# Altium project HT_SHAJUN_PCB.PrjPcb
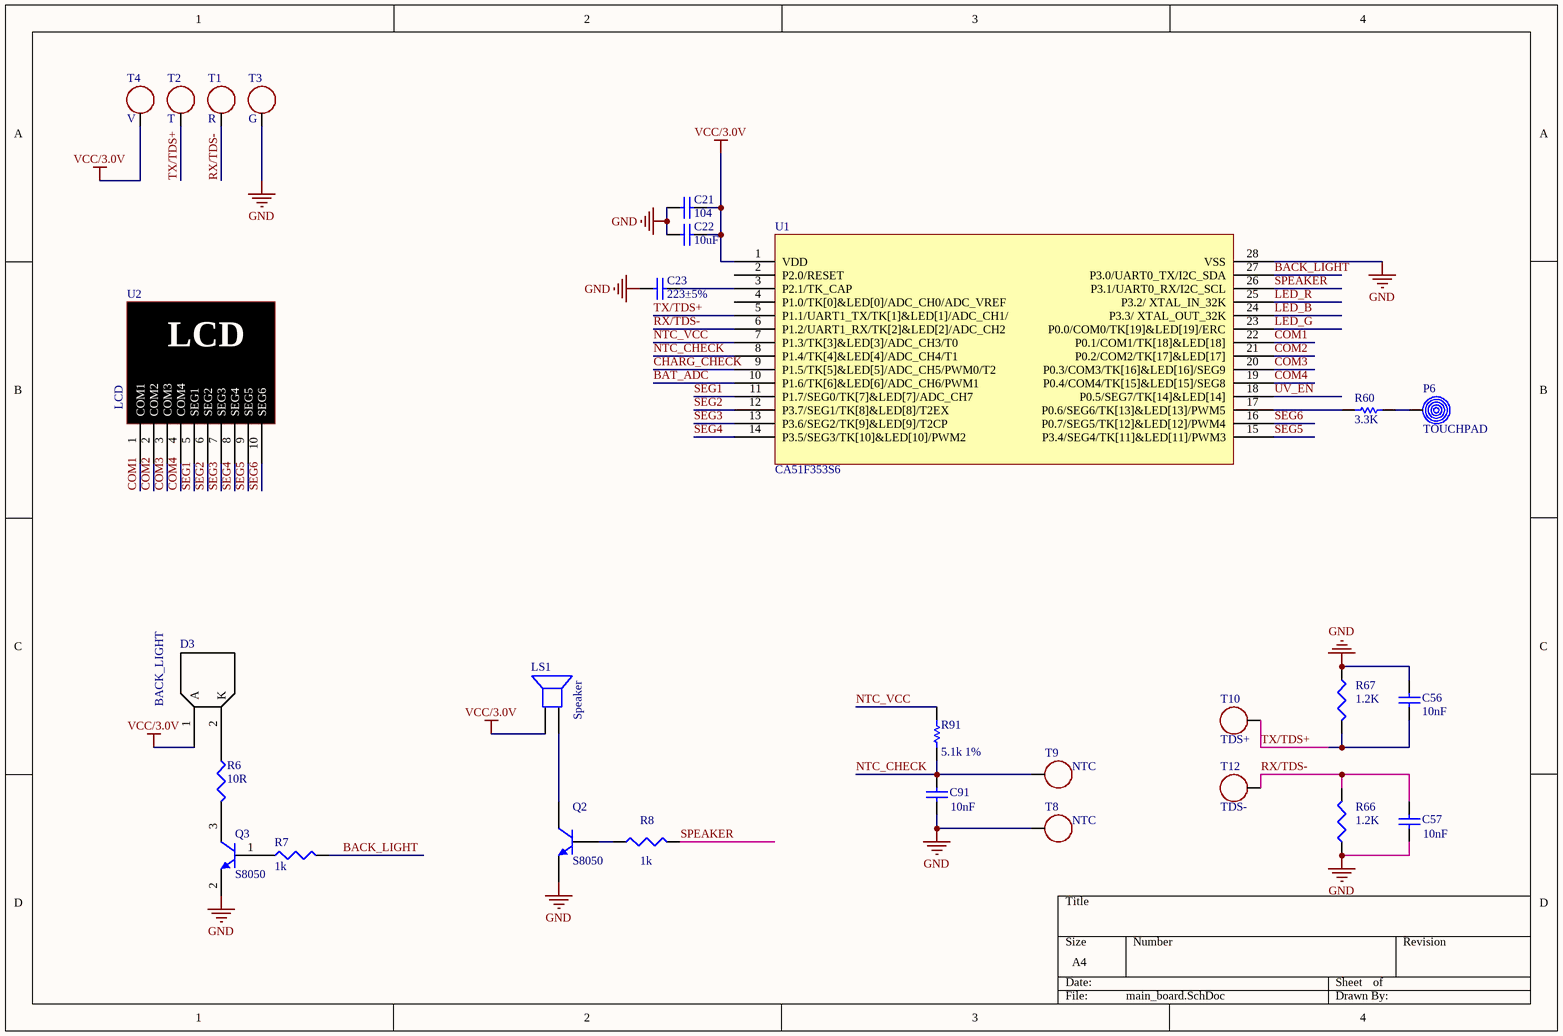
[diagram p0: main_board.SchDoc]
3 sheets, 88 parts. Net scope: global (net labels, ports and power ports of the same name join across sheets).
Board files: SHAJUN_MAIN_PCB.PcbDoc, SHAJUN_VU_PCB.PcbDoc
Sheets:
  main_board.SchDoc
  power_board.SchDoc
  UV_board.SchDoc

## Sheet main_board.SchDoc
size A4

### Parts
C21  value 104  [C0402]  (hidden comment: Cap)
C22  value 10uF  [C0805]  (hidden comment: Cap)
C23  value 223±5%  [C0402]  (hidden comment: Cap)
C56  value 10nF  [C0402]  (hidden comment: Cap)
C57  value 10nF  [C0402]  (hidden comment: Cap)
C91  value 10nF  [C0402]  (hidden comment: Cap)
D3  BACK_LIGHT  [BACK_LIGHT]
LS1  Speaker  [SPEAK]
P6  TOUCHPAD  [TP2MMAAA]
Q2  S8050  [SOT23]
Q3  S8050  [SOT23]
R6  value 10R  [R0402]  (hidden comment: 1.2k)
R7  value 1k  [R0402]  (hidden comment: 1.2k)
R8  value 1k  [R0402]  (hidden comment: 1.2k)
R60  value 3.3K  [R0402]  (hidden comment: Res1)
R66  1.2k  [R0402]
R67  1.2k  [R0402]
R91  value 5.1k 1%  [R0402]  (hidden comment: Res1)
T1  R  [TP1_3MMD]
T2  T  [TP1_3MMD]
T3  G  [TP1_3MMD]
T4  V  [TP1_3MMD]
T8  NTC  [TP1_3MMD]
T9  NTC  [TP1_3MMD]
T10  TDS+  [TP1_3MMD]
T12  TDS-  [TP1_3MMD]
U1  CA51F353S6  [CA51F35S6-SOP28]
U2  LCD  [LCD_DISPLAY]

### Nets
GND: C21.1 C22.1 C23.1 C56.1 C57.1 C91.1 Q2.2(E) Q3.2(E) R66.1 R67.1 T3.1(TOUCHPAD) T8.1(TOUCHPAD) U1.28(VSS)
VCC/3.0V: C21.2 C22.2 D3.1(A) LS1.1 T4.1(TOUCHPAD) U1.1(VDD)
BACK_LIGHT: R7.2 U1.27(P3.0/UART0_TX/I2C_SDA)
BAT_ADC: U1.10(P1.6/TK[6]&LED[6]/ADC_CH6/PWM1)
CHARG_CHECK: U1.9(P1.5/TK[5]&LED[5]/ADC_CH5/PWM0/T2)
COM1: U1.22(P0.1/COM1/TK[18]&LED[18]) U2.1(COM1)
COM2: U1.21(P0.2/COM2/TK[17]&LED[17]) U2.2(COM2)
COM3: U1.20(P0.3/COM3/TK[16]&LED[16]/SEG9) U2.3(COM3)
COM4: U1.19(P0.4/COM4/TK[15]&LED[15]/SEG8) U2.4(COM4)
LED_B: U1.24(P3.3/_XTAL_OUT_32K)
LED_G: U1.23(P0.0/COM0/TK[19]&LED[19]/ERC)
LED_R: U1.25(P3.2/_XTAL_IN_32K)
NTC_CHECK: C91.2 R91.1 T9.1(TOUCHPAD) U1.8(P1.4/TK[4]&LED[4]/ADC_CH4/T1)
NTC_VCC: R91.2 U1.7(P1.3/TK[3]&LED[3]/ADC_CH3/T0)
RX/TDS-: C57.2 R66.2 T1.1(TOUCHPAD) T12.1(TOUCHPAD) U1.6(P1.2/UART1_RX/TK[2]&LED[2]/ADC_CH2)
SEG1: U1.11(P1.7/SEG0/TK[7]&LED[7]/ADC_CH7) U2.5(SEG1)
SEG2: U1.12(P3.7/SEG1/TK[8]&LED[8]/T2EX) U2.6(SEG2)
SEG3: U1.13(P3.6/SEG2/TK[9]&LED[9]/T2CP) U2.7(SEG3)
SEG4: U1.14(P3.5/SEG3/TK[10]&LED[10]/PWM2) U2.8(SEG4)
SEG5: U1.15(P3.4/SEG4/TK[11]&LED[11]/PWM3) U2.9(SEG5)
SEG6: U1.16(P0.7/SEG5/TK[12]&LED[12]/PWM4) U2.10(SEG6)
SPEAKER: R8.2 U1.26(P3.1/UART0_RX/I2C_SCL)
TX/TDS+: C56.2 R67.2 T2.1(TOUCHPAD) T10.1(TOUCHPAD) U1.5(P1.1/UART1_TX/TK[1]&LED[1]/ADC_CH1/)
UV_EN: U1.18(P0.5/SEG7/TK[14]&LED[14])
NetC23_2: C23.2 U1.3(P2.1/TK_CAP)
NetD3_2: D3.2(K) R6.1
NetLS1_2: LS1.2 Q2.3(C)
NetP6_1: P6.1(TOUCHPAD) R60.1
NetQ2_1: Q2.1(B) R8.1
NetQ3_1: Q3.1(B) R7.1
NetQ3_3: Q3.3(C) R6.2
NetR60_2: R60.2 U1.17(P0.6/SEG6/TK[13]&LED[13]/PWM5)

Not connected (* = marked no-connect by the designer): U1 2(P2.0/RESET) 4(P1.0/TK[0]&LED[0]/ADC_CH0/ADC_VREF)

### Library data of the parts
C21-C23 C56 C57 C91 = Cap: 电容; Published: 8-Jun-2000; LatestRevisionDate: 17-Jul-2002; LatestRevisionNote: Re-released for DXP Platform.; PackageReference: RAD-0.3; Publisher: Altium Limited; PackageDescription: Radial Cap, Thru-Hole; 2 Leads; 0.3 in Pin Spacing
D3 = BACK_LIGHT: LCD背光
LS1 = Speaker: 蜂鸣器; Published: 24-Mar-1999; LatestRevisionDate: 17-Jul-2002; LatestRevisionNote: Re-released for DXP Platform.; PackageReference: PIN2; Publisher: Altium Limited
P6 = TOUCHPAD: 触摸弹簧
Q2 Q3 = S8050: 三极管
R6-R8 R66 R67 = Res3: 电阻; Published: 8-Jun-2000; LatestRevisionDate: 29-May-2009; LatestRevisionNote: IPC-7351 Footprint Added.; PackageReference: J1-0603; Publisher: Altium Limited; PackageDescription: Chip Resistor
  R66 R67: Value: 1.2K
R60 R91 = Res1: 电阻; Published: 8-Jun-2000; LatestRevisionDate: 17-Jul-2002; LatestRevisionNote: Re-released for DXP Platform.; PackageReference: AXIAL-0.3; Publisher: Altium Limited; PackageDescription: Axial Device, Thru-Hole; 2 Leads; 0.3 in Pin Spacing
T1 = TEST: 烧录点Rx
T2 = TEST: 烧录点Tx
T3 = TEST: 烧录点GND
T4 = TEST: 烧录点VCC
T8 T9 = TEST: NTC焊点
T10 T12 = TEST: TDS焊点
U1 = CA51F353S6: 主控IC
U2 = LCD: LCD显示屏

## Sheet power_board.SchDoc
size A4
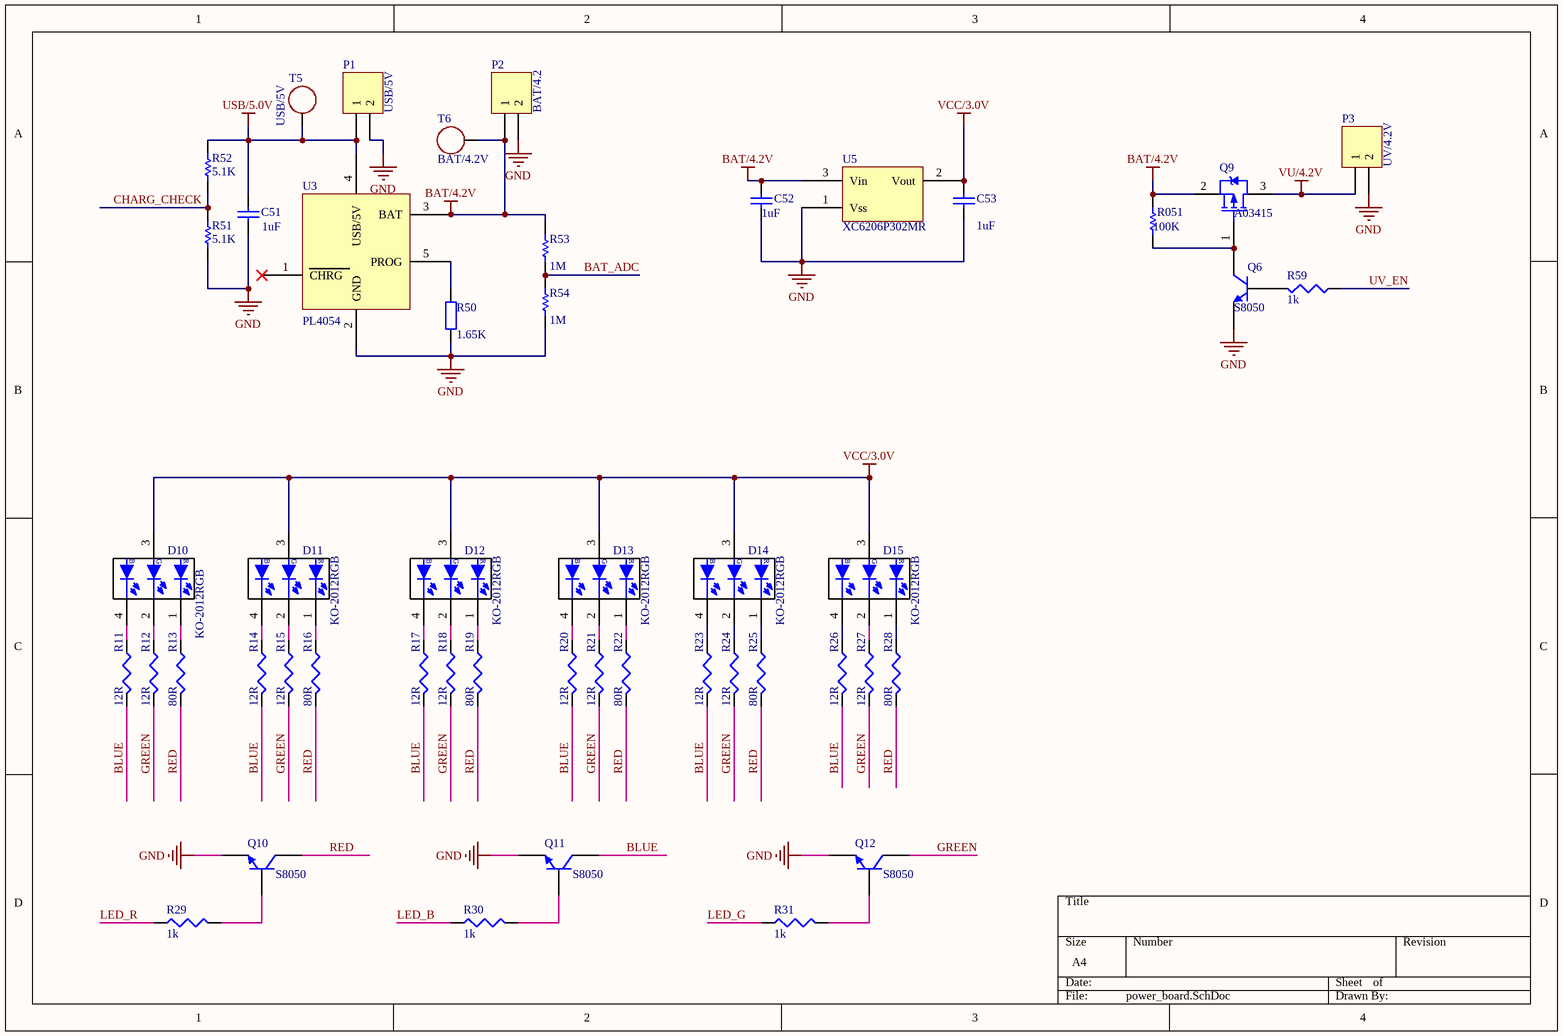
[diagram p1: power_board.SchDoc]

### Parts
C51  value 1uF  [C0402]  (hidden comment: Cap)
C52  value 1uF  [C0402]  (hidden comment: Cap)
C53  value 1uF  [C0402]  (hidden comment: Cap)
D10  KO-2012RGB  [KO-2012RGB]
D11  KO-2012RGB  [KO-2012RGB]
D12  KO-2012RGB  [KO-2012RGB]
D13  KO-2012RGB  [KO-2012RGB]
D14  KO-2012RGB  [KO-2012RGB]
D15  KO-2012RGB  [KO-2012RGB]
P1  USB/5V  [USB5.0V]
P2  BAT/4.2  [CON_1.25MM_2P]
P3  UV/4.2V  [CON_1.25MM_2P]
Q6  S8050  [SOT23]
Q9  A03415  [SOT23]
Q10  S8050  [SOT23]
Q11  S8050  [SOT23]
Q12  S8050  [SOT23]
R11  value 12R  [R0402]  (hidden comment: 1.2k)
R12  value 12R  [R0402]  (hidden comment: 1.2k)
R13  value 80R  [R0402]  (hidden comment: 1.2k)
R14  value 12R  [R0402]  (hidden comment: 1.2k)
R15  value 12R  [R0402]  (hidden comment: 1.2k)
R16  value 80R  [R0402]  (hidden comment: 1.2k)
R17  value 12R  [R0402]  (hidden comment: 1.2k)
R18  value 12R  [R0402]  (hidden comment: 1.2k)
R19  value 80R  [R0402]  (hidden comment: 1.2k)
R20  value 12R  [R0402]  (hidden comment: 1.2k)
R21  value 12R  [R0402]  (hidden comment: 1.2k)
R22  value 80R  [R0402]  (hidden comment: 1.2k)
R23  value 12R  [R0402]  (hidden comment: 1.2k)
R24  value 12R  [R0402]  (hidden comment: 1.2k)
R25  value 80R  [R0402]  (hidden comment: 1.2k)
R26  value 12R  [R0402]  (hidden comment: 1.2k)
R27  value 12R  [R0402]  (hidden comment: 1.2k)
R28  value 80R  [R0402]  (hidden comment: 1.2k)
R29  value 1k  [R0402]  (hidden comment: 1.2k)
R30  value 1k  [R0402]  (hidden comment: 1.2k)
R31  value 1k  [R0402]  (hidden comment: 1.2k)
R50  value 1.65K  [R0402]  (hidden comment: Res2)
R51  value 5.1K  [R0402]  (hidden comment: Res1)
R051  value 100K  [R0402]  (hidden comment: Res1)
R52  value 5.1K  [R0402]  (hidden comment: Res1)
R53  value 1M  [R0402]  (hidden comment: Res1)
R54  value 1M  [R0402]  (hidden comment: Res1)
R59  value 1k  [R0402]  (hidden comment: 1.2k)
T5  USB/5V  [TP1_3MMD]
T6  BAT/4.2V  [TP1_3MMD]
U3  PL4054  [SOT23-5]
U5  XC6206P302MR  [SOT23]

### Nets
BAT/4.2V: C52.2 P2.1 Q9.2(S) R051.2 R53.2 T6.1(TOUCHPAD) U3.3(BAT) U5.3(Vin)
GND: C51.1 C52.1 C53.1 P1.2 P2.2 P3.2 Q6.2(E) Q10.2(E) Q11.2(E) Q12.2(E) R50.1 R51.1 R54.1 U3.2(GND) U5.1(Vss)
USB/5.0V: C51.2 P1.1 R52.2 T5.1(TOUCHPAD) U3.4(USB/5V)
VCC/3.0V: C53.2 D10.3(+) D11.3(+) D12.3(+) D13.3(+) D14.3(+) D15.3(+) U5.2(Vout)
VU/4.2V: P3.1 Q9.3(D)
BAT_ADC: R53.1 R54.2
BLUE: Q11.3(C) R11.2 R14.2 R17.2 R20.2 R23.2 R26.2
CHARG_CHECK: R51.2 R52.1
GREEN: Q12.3(C) R12.2 R15.2 R18.2 R21.2 R24.2 R27.2
LED_B: R30.1
LED_G: R31.1
LED_R: R29.1
RED: Q10.3(C) R13.2 R16.2 R19.2 R22.2 R25.2 R28.2
UV_EN: R59.1
NetD10_1: D10.1(R) R13.1
NetD10_2: D10.2(G) R12.1
NetD10_4: D10.4(B) R11.1
NetD11_1: D11.1(R) R16.1
NetD11_2: D11.2(G) R15.1
NetD11_4: D11.4(B) R14.1
NetD12_1: D12.1(R) R19.1
NetD12_2: D12.2(G) R18.1
NetD12_4: D12.4(B) R17.1
NetD13_1: D13.1(R) R22.1
NetD13_2: D13.2(G) R21.1
NetD13_4: D13.4(B) R20.1
NetD14_1: D14.1(R) R25.1
NetD14_2: D14.2(G) R24.1
NetD14_4: D14.4(B) R23.1
NetD15_1: D15.1(R) R28.1
NetD15_2: D15.2(G) R27.1
NetD15_4: D15.4(B) R26.1
NetQ6_1: Q6.1(B) R59.2
NetQ6_3: Q6.3(C) Q9.1(G) R051.1
NetQ10_1: Q10.1(B) R29.2
NetQ11_1: Q11.1(B) R30.2
NetQ12_1: Q12.1(B) R31.2
NetR50_2: R50.2 U3.5(PROG)

Not connected (* = marked no-connect by the designer): U3 1(CHRG)*

### Library data of the parts
C51-C53 = Cap: 电容; Published: 8-Jun-2000; LatestRevisionDate: 17-Jul-2002; LatestRevisionNote: Re-released for DXP Platform.; PackageReference: RAD-0.3; Publisher: Altium Limited; PackageDescription: Radial Cap, Thru-Hole; 2 Leads; 0.3 in Pin Spacing
D10-D15 = KO-2012RGB: 三色LED
P1 = Header 2: 充电焊接口; LatestRevisionDate: 17-Jul-2002; LatestRevisionNote: Re-released for DXP Platform.; Publisher: Altium Limited
P2 = Header 2: 电池连接母座; LatestRevisionDate: 17-Jul-2002; LatestRevisionNote: Re-released for DXP Platform.; Publisher: Altium Limited
P3 = Header 2: UV灯接口; LatestRevisionDate: 17-Jul-2002; LatestRevisionNote: Re-released for DXP Platform.; Publisher: Altium Limited
Q6 Q10-Q12 = S8050: 三极管
Q9 = A03415: PMOS管
R11-R31 R59 = Res3: 电阻; Published: 8-Jun-2000; LatestRevisionDate: 29-May-2009; LatestRevisionNote: IPC-7351 Footprint Added.; PackageReference: J1-0603; Publisher: Altium Limited; PackageDescription: Chip Resistor
R50 = Res2: 电阻; Published: 8-Jun-2000; LatestRevisionDate: 17-Jul-2002; LatestRevisionNote: Re-released for DXP Platform.; PackageReference: AXIAL-0.4; Publisher: Altium Limited; PackageDescription: Axial Device, Thru-Hole; 2 Leads; 0.4 in Pin Spacing
R51 R051-R54 = Res1: 电阻; Published: 8-Jun-2000; LatestRevisionDate: 17-Jul-2002; LatestRevisionNote: Re-released for DXP Platform.; PackageReference: AXIAL-0.3; Publisher: Altium Limited; PackageDescription: Axial Device, Thru-Hole; 2 Leads; 0.3 in Pin Spacing
T5 = TEST: USB充电检测点
T6 = TEST: 电池检测点
U3 = PL4054: 充电IC
U5 = XC6206P302MR: 稳压IC

## Sheet UV_board.SchDoc
size A4
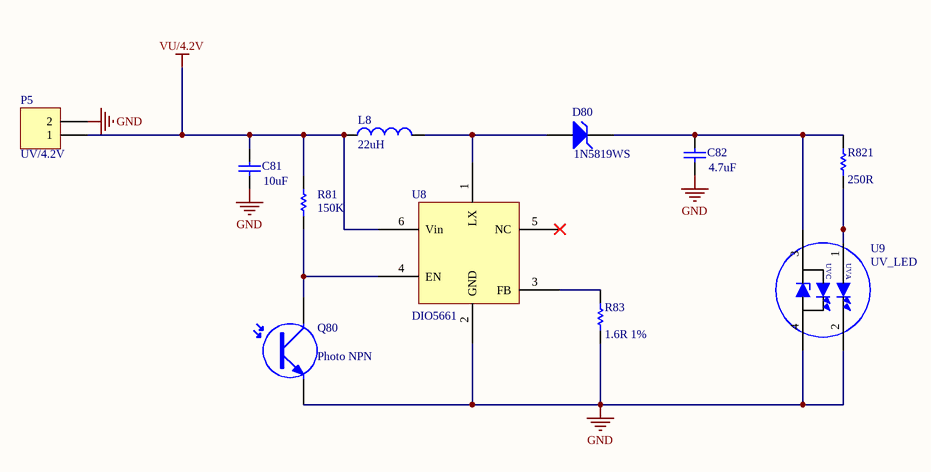
[diagram p2: UV_board.SchDoc]

### Parts
C81  value 10uF  [C0805]  (hidden comment: Cap)
C82  value 4.7uF  [C0402]  (hidden comment: Cap)
D80  1N5819WS  [SOD-323]
L8  value 22uH  [CD32]  (hidden comment: Inductor)
P5  UV/4.2V  [CON_1.25MM_2P]
Q80  Photo NPN  [PT0603]
R81  value 150K  [R0402]  (hidden comment: Res1)
R83  value 1.6R 1%  [R0402]  (hidden comment: Res1)
R821  value 250R  [R0402]  (hidden comment: Res1)
U8  DIO5661  [SOT23-6-1]
U9  UV_LED  [SH35AH]

### Nets
GND: C81.2 C82.2 P5.2 Q80.3(E) R83.1 U8.2(GND) U9.2(+) U9.4(+)
VU/4.2V: C81.1 L8.1 P5.1 R81.2 U8.6(Vin)
NetC82_1: C82.1 D80.2(K) R821.2 U9.3(+)
NetD80_1: D80.1(A) L8.2 U8.1(LX)
NetQ80_1: Q80.1(C) R81.1 U8.4(EN)
NetR83_2: R83.2 U8.3(FB)
NetR821_1: R821.1 U9.1(+)

Not connected (* = marked no-connect by the designer): U8 5(NC)*

### Notes on the sheet
- (in symbol UV_LED) UVC; UVA

### Library data of the parts
C81 C82 = Cap: 电容; Published: 8-Jun-2000; LatestRevisionDate: 17-Jul-2002; LatestRevisionNote: Re-released for DXP Platform.; PackageReference: RAD-0.3; Publisher: Altium Limited; PackageDescription: Radial Cap, Thru-Hole; 2 Leads; 0.3 in Pin Spacing
D80 = D Zener: 二极管; Published: 8-Jun-2000; LatestRevisionDate: 17-Jul-2002; LatestRevisionNote: Re-released for DXP Platform.; PackageReference: DIODE-0.7; Publisher: Altium Limited; PackageDescription: Diode, Thru-Hole; 2 Leads; 0.7 in Pin Spacing
L8 = Inductor: 功率电感; Code_IEC: 1005; Published: 8-Jun-2000; LatestRevisionDate: 29-May-2009; LatestRevisionNote: IPC-7351 Footprint Added.; PackageReference: 0402-A; Publisher: Altium Limited; PackageDescription: Chip Inductor; Code_JEITA: 0402
P5 = Header 2: UV灯电源接口; LatestRevisionDate: 17-Jul-2002; LatestRevisionNote: Re-released for DXP Platform.; Publisher: Altium Limited
Q80 = Photo NPN: 光敏三极管; Published: 24-Mar-1999; LatestRevisionDate: 17-Jul-2002; LatestRevisionNote: Re-released for DXP Platform.; PackageReference: TO-220_A; Publisher: Altium Limited; Code_JEDEC: TO-220-AC
R81 R83 R821 = Res1: 电阻; Published: 8-Jun-2000; LatestRevisionDate: 17-Jul-2002; LatestRevisionNote: Re-released for DXP Platform.; PackageReference: AXIAL-0.3; Publisher: Altium Limited; PackageDescription: Axial Device, Thru-Hole; 2 Leads; 0.3 in Pin Spacing
U8 = DIO5661: 恒流IC

## Nets that join several sheets
GND: main_board (13 pins), power_board (15 pins), UV_board (8 pins)
VCC/3.0V: main_board (6 pins), power_board (8 pins)
VU/4.2V: power_board (P3.1 Q9.3), UV_board (5 pins)
BAT_ADC: main_board (U1.10), power_board (R53.1 R54.2)
CHARG_CHECK: main_board (U1.9), power_board (R51.2 R52.1)
LED_B: main_board (U1.24), power_board (R30.1)
LED_G: main_board (U1.23), power_board (R31.1)
LED_R: main_board (U1.25), power_board (R29.1)
UV_EN: main_board (U1.18), power_board (R59.1)